# EAGLE design rx5808 vTup 1.1 (restored) (EAGLE 7.4.0)
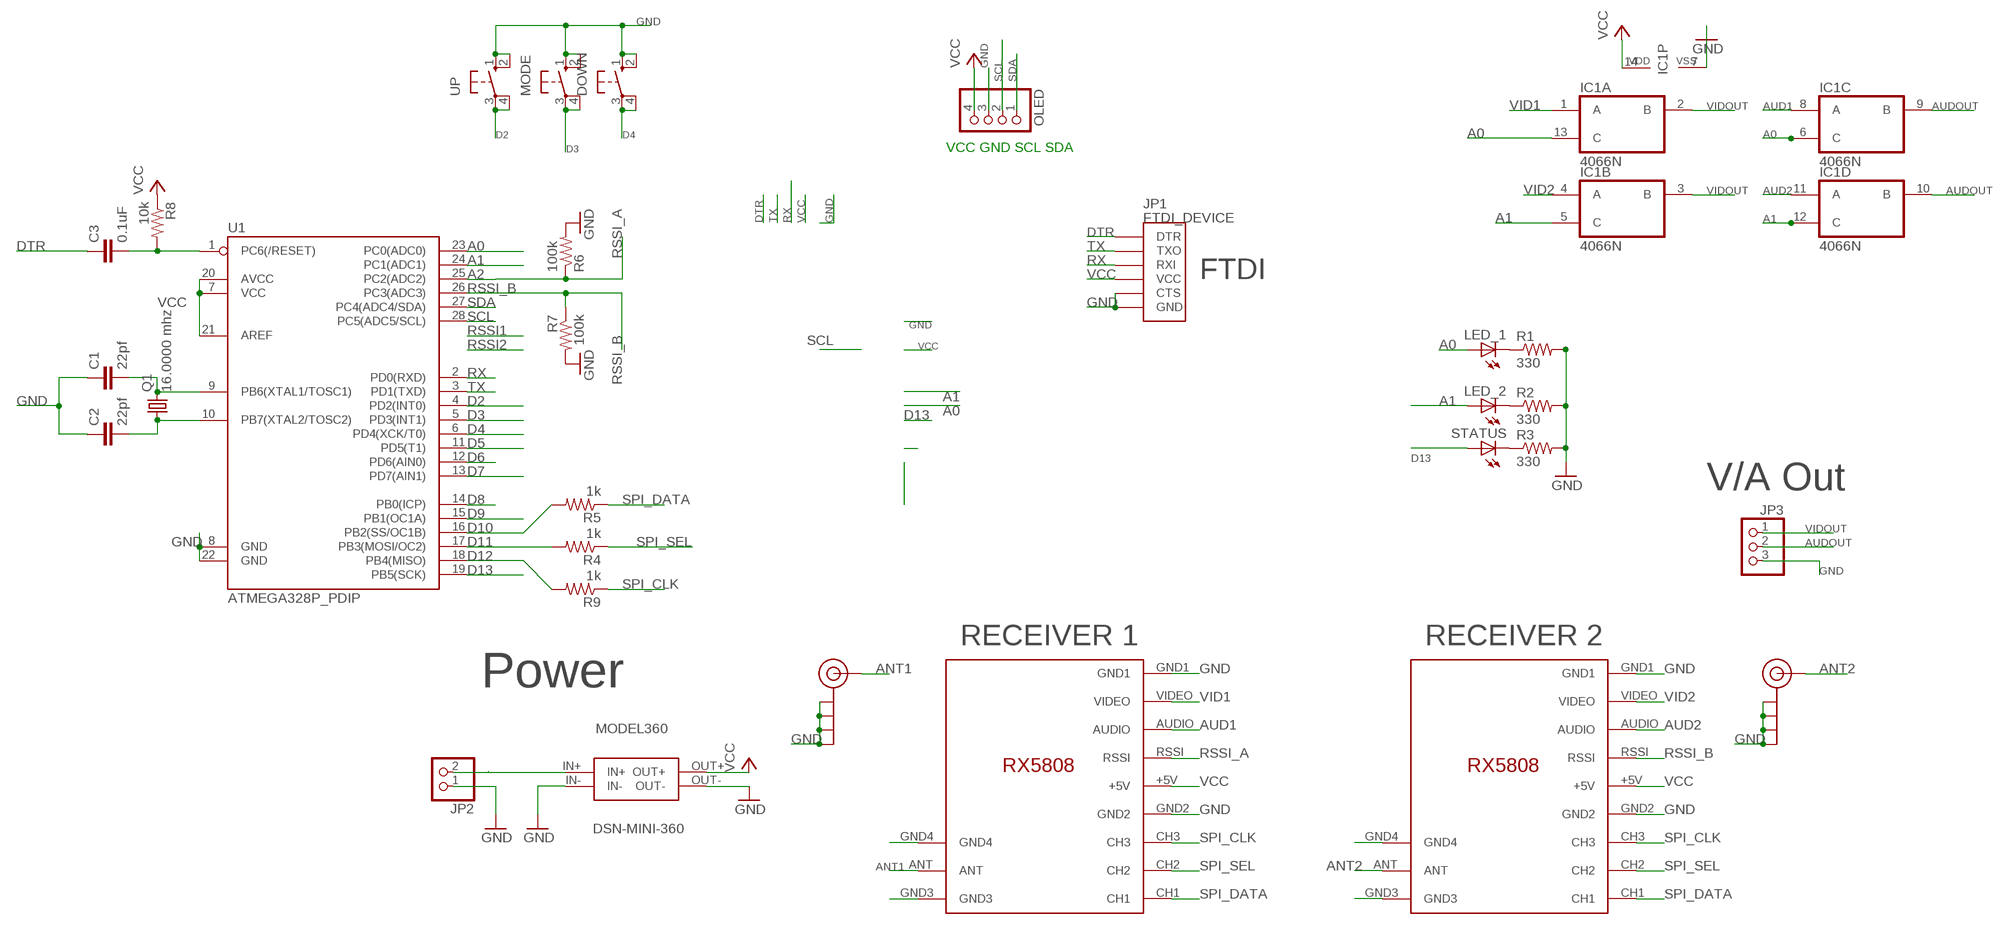
[diagram p0: schematic, sheet 1]

## Parts
ANT1  SMA_EDGE  [SMA-EDGE]
ANT2  SMA_EDGE  [SMA-EDGE]
C1  22pf  C-EU025-025X050  [C025-025X050]
C2  22pf  C-EU025-025X050  [C025-025X050]
C3  0.1uF  C-EU025-025X050  [C025-025X050]
DOWN  10-XX  [B3F-10XX]
DSN-MINI-360  MODEL360  [MODEL360]
IC1  4066N  [DIL14]
JP1  FTDI_DEVICE  [FTDI_DEVICE_SIDE]
JP2  PINHD-1X2  [1X02]
JP3  PINHD-1X3  [1X03]
LED_1  LED5MM  [LED5MM]
LED_2  LED5MM  [LED5MM]
MODE  10-XX  [B3F-10XX]
OLED  PINHD-1X4  [1X04]
Q1  16.0000 mhz  CRYSTALHC49U-V  [HC49U-V]
R1  330  R-US_0207/7  [0207/7]
R2  330  R-US_0207/7  [0207/7]
R3  330  R-US_0207/7  [0207/7]
R4  1k  R-US_0207/7  [0207/7]
R5  1k  R-US_0207/7  [0207/7]
R6  100k  R-US_0207/7  [0207/7]
R7  100k  R-US_0207/7  [0207/7]
R8  10k  R-US_0207/7  [0207/7]
R9  1k  R-US_0207/7  [0207/7]
RECEIVER_A  RX5808_A  RX5808  [RX5808]
RECEIVER_B  RX5808_B  RX5808  [RX5808]
STATUS  LED5MM  [LED5MM]
U1  ATMEGA328P_PDIP  [DIL28-3]
UP  10-XX  [B3F-10XX]

## Nets
A0: IC1.6(C:C) IC1.13(A:C) LED_1.A U1.23(PC0(ADC0))
A1: IC1.5(B:C) IC1.12(D:C) LED_2.A U1.24(PC1(ADC1))
A2: U1.25(PC2(ADC2))
ANT1: ANT1.SIG(SIGNAL) RECEIVER_A.ANT
ANT2: ANT2.SIG(SIGNAL) RECEIVER_B.ANT
AUD1: IC1.8(C:A) RECEIVER_A.AUDIO
AUD2: IC1.11(D:A) RECEIVER_B.AUDIO
AUDOUT: IC1.9(C:B) IC1.10(D:B) JP3.2
D2: U1.4(PD2(INT0)) UP.3(P) UP.4(P1)
D3: MODE.3(P) MODE.4(P1) U1.5(PD3(INT1))
D4: DOWN.3(P) DOWN.4(P1) U1.6(PD4(XCK/T0))
D5: U1.11(PD5(T1))
D6: U1.12(PD6(AIN0))
D7: U1.13(PD7(AIN1))
D8: U1.14(PB0(ICP))
D9: U1.15(PB1(OC1A))
D10: R5.2 U1.16(PB2(SS/OC1B))
D11: R4.2 U1.17(PB3(MOSI/OC2))
D12: R9.2 U1.18(PB4(MISO))
D13: STATUS.A U1.19(PB5(SCK))
DTR: C3.1 JP1.P$1(DTR)
GND: ANT1.GND@0(GND) ANT1.GND@1(GND) ANT1.GND@2(GND) ANT1.GND@3(GND) ANT2.GND@0(GND) ANT2.GND@1(GND) ANT2.GND@2(GND) ANT2.GND@3(GND) C1.1 C2.1 DOWN.1(S) DOWN.2(S1) DSN-MINI-360.IN- DSN-MINI-360.OUT- IC1.7(P:VSS) JP1.P$5(CTS) JP1.P$6(GND) JP2.1 JP3.3 MODE.1(S) MODE.2(S1) OLED.3 R1.2 R2.2 R3.2 R6.2 R7.2 RECEIVER_A.GND1 RECEIVER_A.GND2 RECEIVER_A.GND3 RECEIVER_A.GND4 RECEIVER_B.GND1 RECEIVER_B.GND2 RECEIVER_B.GND3 RECEIVER_B.GND4 U1.8(GND) U1.22(GND) UP.1(S) UP.2(S1)
N$1: LED_1.K(C) R1.1
N$2: LED_2.K(C) R2.1
N$3: R3.1 STATUS.K(C)
N$5: DSN-MINI-360.IN+ JP2.2
N$6: C1.2 Q1.2 U1.9(PB6(XTAL1/TOSC1))
N$7: C2.2 Q1.1 U1.10(PB7(XTAL2/TOSC2))
RESET: C3.2 R8.2 U1.1(PC6(/RESET))
RSSI_A: R6.1 RECEIVER_A.RSSI
RSSI_B: R7.1 RECEIVER_B.RSSI U1.26(PC3(ADC3))
RX: JP1.P$3(RXI) U1.2(PD0(RXD))
SCL: OLED.2 U1.28(PC5(ADC5/SCL))
SDA: OLED.1 U1.27(PC4(ADC4/SDA))
SPI_CLK: R9.1 RECEIVER_A.CH3 RECEIVER_B.CH3
SPI_DATA: R5.1 RECEIVER_A.CH1 RECEIVER_B.CH1
SPI_SEL: R4.1 RECEIVER_A.CH2 RECEIVER_B.CH2
TX: JP1.P$2(TXO) U1.3(PD1(TXD))
VCC: DSN-MINI-360.OUT+ IC1.14(P:VDD) JP1.P$4(VCC) OLED.4 R8.1 RECEIVER_A.+5V RECEIVER_B.+5V U1.7(VCC) U1.20(AVCC) U1.21(AREF)
VID1: IC1.1(A:A) RECEIVER_A.VIDEO
VID2: IC1.4(B:A) RECEIVER_B.VIDEO
VIDOUT: IC1.2(A:B) IC1.3(B:B) JP3.1

## Notes on the sheet
- VCC GND SCL SDA
- FTDI
- V/A Out
- RECEIVER 1 | RECEIVER 2
- Power

## Library data of the parts
ANT1 ANT2 = SparkFun-Connectors:SMA_EDGE: SMA Antenna Connector End launch SMA connector. The paste layer has been removed so that the connector can be hand soldered onto the board after reflow.
C1-C3 = resistor:C-EU: CAPACITOR, European symbol
DOWN MODE UP = switch-omron:10-XX: OMRON SWITCH; MPN: B3F-1000; OC_FARNELL: 176432; OC_NEWARK: 36M3542
DSN-MINI-360 = Model-360-Step-Down:MODEL360
IC1 = 40xx:4066: Quad bilateral ANALOG SWITCH
JP1 = SparkFun-Connectors:FTDI_DEVICE: Connector which mates to FTDI basic or FTDI cable.
JP2 = pinhead:PINHD-1X2: PIN HEADER
JP3 = pinhead:PINHD-1X3: PIN HEADER
LED_1 LED_2 STATUS = led:LED: LED OSRAM: - CHIPLED LG R971, LG N971, LY N971, LG Q971, LY Q971, LO R971, LY R971 LH N974, LH R974 LS Q976, LO Q976, LY Q976 LO Q996 - Hyper CHIPLED LW Q18S LB Q993, LB Q99A, LB R99A - SideLED LS A670, LO A670, LY A670, LG A670, LP A670 LB A673, LV A673, LT A673, LW A673 LH A674 LY A675 LS A676, LA A676, LO A676, LY A676, LW A676 LS A679, LY A679, LG A679 - Hyper Micro SIDELED® LS Y876, LA Y876, LO Y876, LY Y876 LT Y87S - SmartLED LW L88C, LW L88S LB L89C, LB L89S, LG L890 LS L89K, LO L89K, LY L89K LS L896, LA L896, LO L896, LY L896 - TOPLED LS T670, LO T670, LY T670, LG T670, LP T670 LSG T670, LSP T670, LSY T670, LOP T670, LYG T670 LG T671, LOG T671, LSG T671 LB T673, LV T673, LT T673, LW T673 LH T674 LS T676, LA T676, LO T676, LY T676, LB T676, LH T676, LSB T676, LW T676 LB T67C, LV T67C, LT T67C, LS T67K, LO T67K, LY T67K, LW E67C LS E67B, LA E67B, LO E67B, LY E67B, LB E67C, LV E67C, LT E67C LW T67C LS T679, LY T679, LG T679 LS T770, LO T770, LY T770, LG T770, LP T770 LB T773, LV T773, LT T773, LW T773 LH T774 LS E675, LA E675, LY E675, LS T675 LS T776, LA T776, LO T776, LY T776, LB T776 LHGB T686 LT T68C, LB T68C - Hyper Mini TOPLED® LB M676 - Mini TOPLED Santana® LG M470 LS M47K, LO M47K, LY M47K Source: http://www.osram.convergy.de LUXEON: - LUMILED® LXK2-PW12-R00, LXK2-PW12-S00, LXK2-PW14-U00, LXK2-PW14-V00 LXK2-PM12-R00, LXK2-PM12-S00, LXK2-PM14-U00 LXK2-PE12-Q00, LXK2-PE12-R00, LXK2-PE12-S00, LXK2-PE14-T00, LXK2-PE14-U00 LXK2-PB12-K00, LXK2-PB12-L00, LXK2-PB12-M00, LXK2-PB14-N00, LXK2-PB14-P00, LXK2-PB14-Q00 LXK2-PR12-L00, LXK2-PR12-M00, LXK2-PR14-Q00, LXK2-PR14-R00 LXK2-PD12-Q00, LXK2-PD12-R00, LXK2-PD12-S00 LXK2-PH12-R00, LXK2-PH12-S00 LXK2-PL12-P00, LXK2-PL12-Q00, LXK2-PL12-R00 Source: www.luxeon.com KINGBRIGHT: KA-3528ASYC Source: www.kingbright.com
OLED = pinhead:PINHD-1X4: PIN HEADER
Q1 = crystal:CRYSTAL: CRYSTAL; OC_FARNELL: 1666969; OC_NEWARK: unknown
R1-R9 = rcl:R-US_: RESISTOR, American symbol
RECEIVER_A RECEIVER_B = 1customstuff:RX5808
U1 = SparkFun-DigitalIC:ATMEGA328P_PDIP: uC used in the Arduino 32kb flash, 1k EEPROM, 2k SRAM This is the through-hole version of this chip.

## Board
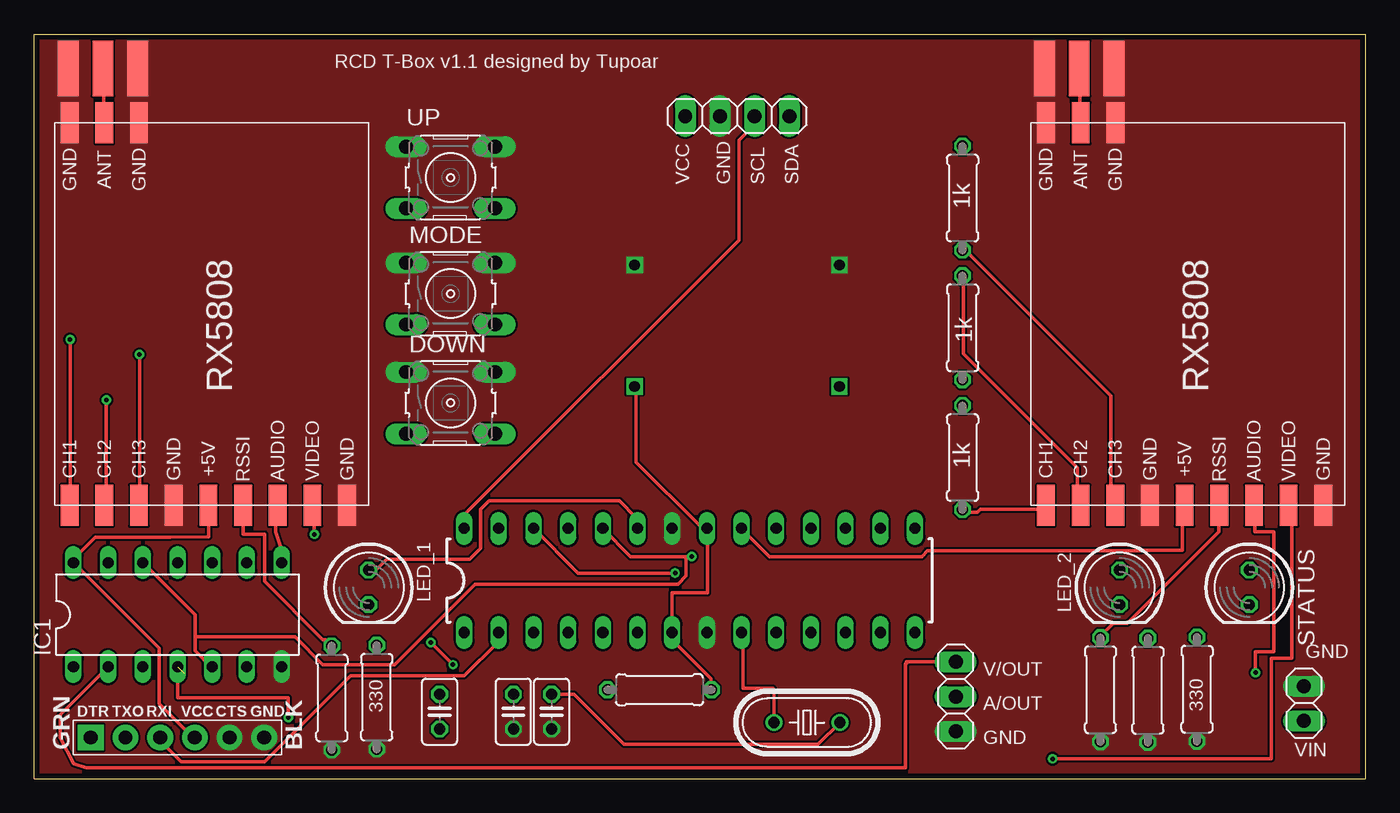
[diagram p1: board, top side]
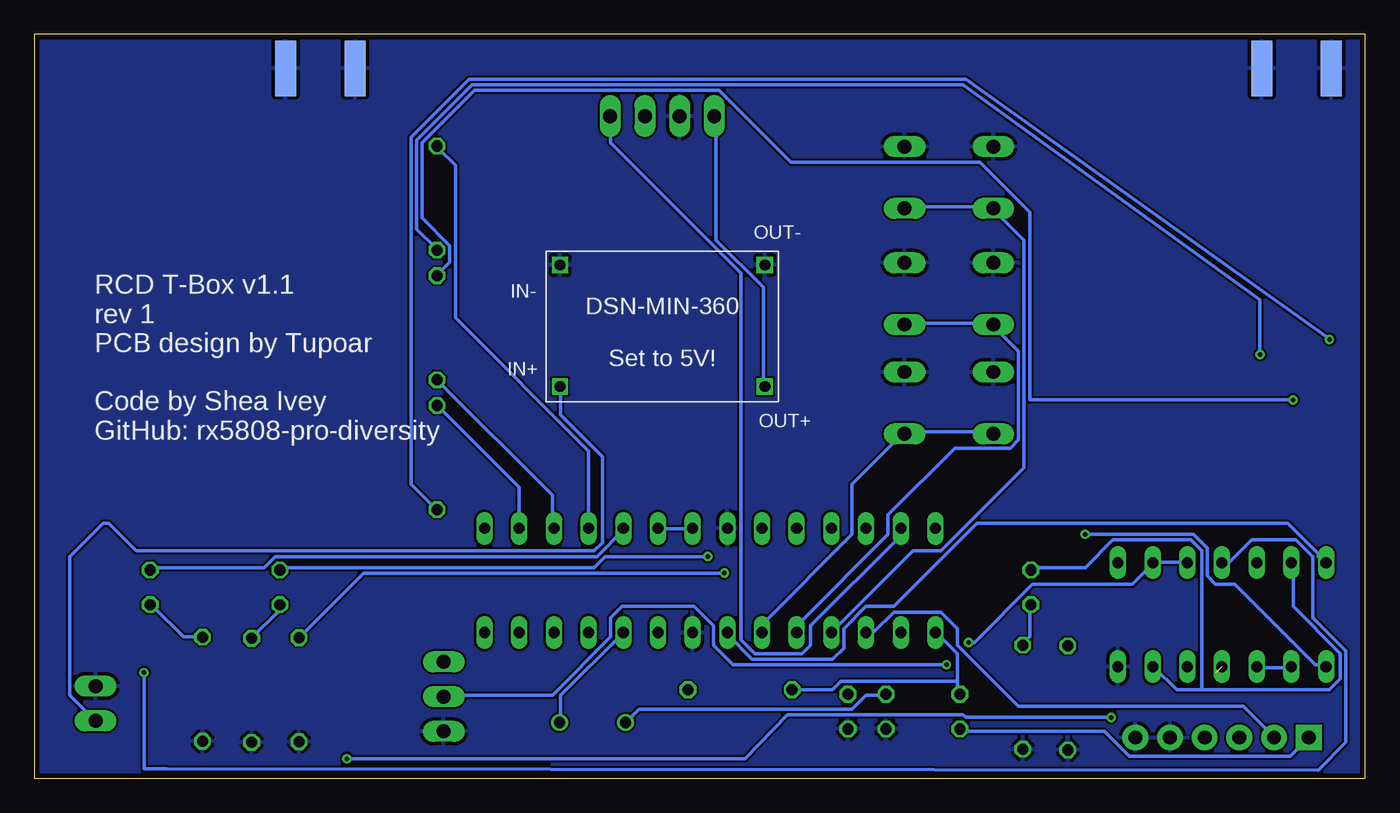
[diagram p2: board, bottom side, seen from below]

Size 97.5 x 54.5 mm. Coordinates in mm from the lower left corner, seen from the top.
Outline: 0,0 97.5,0 97.5,54.5 0,54.5 0,0
Copper layers (1*16): Top 0.0356mm / dielectric 1.5011mm / Bottom 0.0356mm
Design rules "LaenPCBOrder *": minimum track width 10mil, minimum drill 13mil, track to track 6mil, track to pad 6mil, pad to pad 6mil, via to via 30mil, smd to smd 6mil, copper to edge 15mil, drill to drill 6mil, minimum pad ring 7mil, minimum via ring 7mil, stop-mask expansion 3mil, vias tented up to drill 0mil, thermal gap 10mil

### Footprints (pad centres in the part's own frame; a part is rotated, then mirrored left to right if it is on the bottom)
SMA-EDGE = smd 1.524 x 4.064: GND@0 0,0; GND@1 5.08,0; SIG 2.54,0 | smd 1.524 x 4.064 bottom: GND@2 0,0; GND@3 5.08,0
C025-025X050 = drill 0.813 octagon: 1 -1.27,0; 2 1.27,0
B3F-10XX = drill 1.016 long: 1 -3.251,2.261; 2 3.251,2.261; 3 -3.251,-2.261; 4 3.251,-2.261
MODEL360 = drill 0.8 square: IN+ 1.02,-7.4; IN- 1.02,1.5; OUT+ 16.02,-7.4; OUT- 16.02,1.5
DIL14 = drill 0.813 long: 1 -7.62,-3.81; 2 -5.08,-3.81; 3 -2.54,-3.81; 4 0,-3.81; 5 2.54,-3.81; 6 5.08,-3.81; 7 7.62,-3.81; 8 7.62,3.81; 9 5.08,3.81; 10 2.54,3.81; 11 0,3.81; 12 -2.54,3.81; 13 -5.08,3.81; 14 -7.62,3.81
FTDI_DEVICE_SIDE = drill 1.016 pad 1.88 square: P$1 -6.35,0 | drill 1.016 pad 1.88: P$2 -3.81,0; P$3 -1.27,0; P$4 1.27,0; P$5 3.81,0; P$6 6.35,0
1X02 = drill 1.016 long: 1 -1.27,0; 2 1.27,0
1X03 = drill 1.016 long: 1 -2.54,0; 2 0,0; 3 2.54,0
LED5MM = drill 0.813 octagon: A -1.27,0; K 1.27,0
1X04 = drill 1.016 long: 1 -3.81,0; 2 -1.27,0; 3 1.27,0; 4 3.81,0
HC49U-V = drill 0.813: 1 -2.413,0; 2 2.413,0
0207/7 = drill 0.813 octagon: 1 -3.81,0; 2 3.81,0
RX5808 = smd 3 x 1.3: +5V 28,11.26; ANT 0,3.64; AUDIO 28,16.34; CH1 28,1.1; CH2 28,3.64; CH3 28,6.18; GND1 28,21.42; GND2 28,8.72; GND3 0,1.1; GND4 0,6.18; RSSI 28,13.8; VIDEO 28,18.88
DIL28-3 = drill 0.813 long: 1 -16.51,-3.81; 2 -13.97,-3.81; 3 -11.43,-3.81; 4 -8.89,-3.81; 5 -6.35,-3.81; 6 -3.81,-3.81; 7 -1.27,-3.81; 8 1.27,-3.81; 9 3.81,-3.81; 10 6.35,-3.81; 11 8.89,-3.81; 12 11.43,-3.81; 13 13.97,-3.81; 14 16.51,-3.81; 15 16.51,3.81; 16 13.97,3.81; 17 11.43,3.81; 18 8.89,3.81; 19 6.35,3.81; 20 3.81,3.81; 21 1.27,3.81; 22 -1.27,3.81; 23 -3.81,3.81; 24 -6.35,3.81; 25 -8.89,3.81; 26 -11.43,3.81; 27 -13.97,3.81; 28 -16.51,3.81

### Placement (x,y rotation side)
ANT1  2.5,52 0 top
ANT2  74,52 0 top
C1  35.1,4.9 90 top
C2  37.9,4.9 90 top
C3  29.7,4.9 90 top
DOWN  30.5,27.5 0 top
DSN-MINI-360  60,36.1 0 bottom
IC1  10.5,12 0 top
JP1  10.5,3 0 top
JP2  93,5.5 270 top
JP3  67.5,6 270 top
LED_1  24.5,14 270 top
LED_2  79.5,14 270 top
MODE  30.5,35.5 0 top
OLED  51.5,48.5 180 top
Q1  56.6,4.1 180 top
R1  25.09,5.96 270 top
R2  81.57,6.46 270 top
R3  85.17,6.54 270 top
R4  68,33 270 top
R5  68,23.5 90 top
R6  21.8,5.9 270 top
R7  78.1,6.5 270 top
R8  45.8,6.5 180 top
R9  68,42.5 90 top
RECEIVER_A  1.5,48 270 top
RECEIVER_B  73,48 270 top
STATUS  89,14 270 top
U1  48,14.5 0 top
UP  30.5,44 0 top

### Tracks (layer width: path | path; a pad name or v marks a point on that pad's centre or on a via)
A0
  Top 0.254: U1.23 44.09,18.49 44.09,19.1 42.88,20.32 33.33,20.32 32.72,19.71 32.72,16.87 31.9,16.05 25.81,16.05 24.99,15.24 24.59,15.24 LED_1.A
  Bottom 0.254: 11.99,6.5 13.82,6.5 15.44,8.13 IC1.6 | 11.99,6.5 2.64,6.5 1.83,7.32 1.83,9.14 5.28,12.6 5.28,15.65 IC1.13 | 11.99,6.5 11.99,16.66 12.8,17.48 18.49,17.48 20.52,15.44 24.38,15.44 LED_1.A
A1  (via drill 0.33)
  Top 0.254: 11.79,10.36 11.79,9.35 13.01,8.13 IC1.5 | 11.79,10.36 11.79,11.99 8.13,15.65 IC1.12 | v48.16,16.26 47.75,16.26 | 47.75,16.26 43.69,16.26 41.66,18.29 U1.24 | 11.79,10.36 19.1,10.36 21.13,8.33 26.42,8.33 32.31,14.22 47.14,14.22 47.75,14.83 47.75,16.26
  Bottom 0.254: v48.16,16.26 55.68,16.26 56.49,15.44 79.45,15.44 LED_2.A
ANT1
  Top 0.254: RECEIVER_A.ANT 5.08,48.16 5.08,51.82 ANT1.SIG
ANT2
  Top 0.254: RECEIVER_B.ANT 76.61,48.16 76.61,51.82 ANT2.SIG
AUD1
  Top 0.254: IC1.8 18.09,15.85 18.09,16.87 17.68,18.09 17.68,19.91 RECEIVER_A.AUDIO
AUD2  (via drill 0.33)
  Top 0.254: RECEIVER_B.AUDIO 89.41,19.91 89.41,18.09 90.8,18.09 90.8,9.3 89.45,9.3 v89.45,7.75
  Bottom 0.254: IC1.11 10.36,15.85 9.96,15.85 8.33,17.48 5.08,17.48 3.86,16.26 3.86,11.79 1.42,9.35 1.42,2.64 3.45,0.61 87.8,0.71 89.45,0.71 v89.45,7.75
AUDOUT  (via drill 0.33)
  Top 0.254: v29.06,9.96 v30.68,8.33
  Bottom 0.254: IC1.10 13.21,15.85 15.44,15.85 IC1.9 15.65,15.65 17.07,14.22 24.38,14.22 28.65,9.96 v29.06,9.96 | v30.68,8.33 46.33,8.33 47.75,9.75 47.75,11.18 49.17,12.6 54.46,12.6 55.27,11.79 55.27,10.36 59.54,6.1 67.46,6.1 JP3.2
D2
  Bottom 0.254: U1.4 39.01,10.77 33.12,16.66 31.09,16.66 24.99,22.76 24.99,39.42 27.23,41.66 UP.3 27.43,41.86 33.73,41.86 UP.4
D3
  Bottom 0.254: U1.5 41.45,10.77 41.45,11.38 34.95,17.88 34.95,19.3 30.07,24.18 26.01,24.18 25.4,24.79 25.4,31.29 27.23,33.12 MODE.3 27.43,33.33 33.73,33.33 MODE.4
D4
  Bottom 0.254: U1.6 44.09,10.77 44.09,11.38 37.59,17.88 37.59,21.54 33.93,25.2 DOWN.4 33.73,25.4 27.43,25.4 DOWN.3
D10
  Bottom 0.254: U1.16 61.98,18.49 61.98,21.34 67.87,27.23 R5.2
D11
  Bottom 0.254: U1.17 59.54,18.49 59.54,20.73 67.87,29.06 R4.2
D12
  Bottom 0.254: U1.18 56.9,18.49 56.9,23.98 66.65,33.73 66.65,44.91 67.87,46.13 R9.2
D13
  Bottom 0.254: STATUS.A 88.8,15.44 80.67,15.44 79.86,16.26 56.29,16.26 54.25,18.29 U1.19
DTR
  Bottom 0.254: C3.1 29.67,3.45 19.1,3.45 17.27,1.63 5.49,1.63 4.27,2.85 JP1.P$1
GND
  pour Bottom: 0,54.5 97.5,54.5 97.5,0 0,0
  pour Top (no thermals): 0,54.5 97.5,54.5 97.5,0 0,0
N$1
  Bottom 0.254: LED_1.K 24.59,12.6 24.59,10.36 24.99,9.96 R1.1
N$2
  Bottom 0.254: LED_2.K 79.65,12.6 79.65,12.19 81.48,10.36 R2.1
N$3
  Bottom 0.254: R3.1 85.34,10.36 86.56,10.36 88.8,12.6 STATUS.K
N$5
  Bottom 0.254: DSN-MINI-360.IN+ 58.93,28.65 58.93,26.62 55.88,23.57 55.88,17.27 56.49,16.66 90.02,16.66 92.05,18.69 92.46,18.69 94.89,16.26 94.89,6.1 93.07,4.27 JP2.2
N$6
  Top 0.254: Q1.2 54.19,6.5 54.1,6.5 54.1,6.6 51.9,6.6 51.9,10.57 51.82,10.57 U1.9
  Bottom 0.254: C1.2 35.15,6.1 36.58,6.1 37.59,5.08 53.21,5.08 Q1.2
N$7
  Top 0.254: C2.2 39.53,6.17 43.2,2.5 57.41,2.5 Q1.1
  Bottom 0.254: Q1.1 58.93,4.27 58.93,6.1 54.46,10.57 U1.10
RESET
  Bottom 0.254: 29.87,7.11 29.87,9.14 31.29,10.57 U1.1 | 29.87,7.11 29.87,6.3 C3.2 | 29.87,7.11 38.41,7.11 39.01,6.5 41.86,6.5 R8.2
RSSI_A
  Top 0.254: R6.1 21.74,9.75 21.34,10.16 21.13,10.16 16.87,14.43 16.87,17.9 15.3,17.9 RECEIVER_A.RSSI 15.44,19.91
RSSI_B  (via drill 0.33)
  Top 0.254: v46.94,15.04 39.83,15.04 U1.26 36.58,18.29 | RECEIVER_B.RSSI 86.77,19.91 86.77,18.09 80.06,11.38 79.05,11.38 78.03,10.36 R7.1
  Bottom 0.254: v46.94,15.04 73.36,15.04 78.03,10.36 R7.1
RX
  Top 0.254: U1.2 33.93,10.57 33.93,9.96 31.5,7.52 23.16,7.52 16.87,1.22 10.77,1.22 9.14,2.85 JP1.P$3
SCL
  Top 0.254: U1.28 31.5,18.49 31.5,19.3 51.61,39.42 51.61,46.74 52.63,47.75 52.63,48.36 OLED.2
SDA
  Bottom 0.254: U1.27 34.14,18.29 34.14,17.68 40.64,11.18 40.64,9.75 41.25,9.14 44.7,9.14 45.72,10.16 45.72,36.98 55.27,46.53 55.27,48.36 OLED.1
SPI_CLK  (via drill 0.33)
  Top 0.254: R9.1 68.07,38.61 68.28,38.61 78.84,28.04 78.84,20.32 79.05,20.12 RECEIVER_B.CH3 | v7.72,31.05 7.72,20.12 RECEIVER_A.CH3
  Bottom 0.254: v7.72,31.05 7.72,35.06 29.46,50.8 65.43,50.8 69.49,46.74 69.49,40.23 68.07,38.81 R9.1
SPI_DATA  (via drill 0.33)
  Top 0.254: R5.1 68.07,19.51 69.09,19.51 69.29,19.71 73.76,19.71 73.97,19.91 RECEIVER_B.CH1 | v2.64,32.15 2.64,20.12 RECEIVER_A.CH1
  Bottom 0.254: v2.64,32.15 2.64,32.19 29.26,51.21 65.63,51.21 69.9,46.94 69.9,21.54 68.07,19.71 R5.1
SPI_SEL  (via drill 0.33)
  Top 0.254: R4.1 68.07,36.78 68.07,31.09 76.4,22.76 76.4,20.32 76.61,20.12 RECEIVER_B.CH2 | RECEIVER_A.CH2 5.28,20.12 5.28,27.72 v5.3,27.72
  Bottom 0.254: R4.1 67.87,36.98 67.06,37.8 67.06,39.01 69.09,41.05 69.09,46.53 65.23,50.39 47.35,50.39 42.06,45.11 28.25,45.11 24.59,41.45 24.59,27.72 v5.3,27.72
TX
  Bottom 0.254: U1.3 36.37,10.77 35.97,10.77 34.54,12.19 31.09,12.19 29.87,10.97 29.87,9.75 25.4,5.28 8.94,5.28 6.71,3.05 JP1.P$2
VCC
  Top 0.254: 12.8,19.91 RECEIVER_A.+5V 12.8,17.7 9.96,17.68 4.47,17.68 3.05,16.26 3.05,15.85 IC1.14 3.05,15.65 9.14,9.55 9.14,5.49 11.58,3.05 JP1.P$4 | R8.1 49.58,6.5 49.58,7.32 46.74,10.16 46.74,10.57 U1.7 46.73,13.6 49.3,13.6 49.3,18.31 U1.21 49.17,18.49 48.77,18.49 44.09,23.16 44.09,28.65 DSN-MINI-360.OUT+ | RECEIVER_B.+5V 84.12,19.91 84.1,19.91 84.1,16.7 81.08,16.7 81.08,16.66 65.43,16.66 65.02,16.26 53.85,16.26 51.82,18.29 U1.20
  Bottom 0.254: DSN-MINI-360.OUT+ 44.09,28.85 44.09,35.97 47.55,39.42 47.55,48.36 OLED.4 | U1.20 51.61,18.29 49.38,18.29 U1.21 | IC1.14 3.05,15.85 3.45,16.26 3.45,16.46 5.69,18.69 28.45,18.69 34.54,12.6 36.58,12.6 38.2,10.97 38.2,9.55 39.01,8.74 44.91,8.74 46.74,10.57 U1.7
VID1  (via drill 0.33)
  Top 0.254: v20.51,17.88 20.52,18.49 20.52,19.91 RECEIVER_A.VIDEO
  Bottom 0.254: IC1.1 3.05,8.33 3.66,8.33 9.55,14.22 10.97,14.22 11.58,14.83 11.58,16.87 12.6,17.88 v20.51,17.88
VID2  (via drill 0.33)  (1 unrouted)
  Top 0.254: 10.97,7.52 10.97,7.72 | RECEIVER_B.VIDEO 92.05,19.91 92.1,19.91 92.1,8.8 90.6,8.8 90.6,1.45 v74.6,1.45 | IC1.4 10.5,5.9 18.6,5.9 18.6,4.47 v18.62,4.47
  Bottom 0.254: v18.62,4.47 29.26,4.47 29.46,4.67 42.32,4.67 45.45,1.45 v74.6,1.45
VIDOUT
  Top 0.254: JP3.1 63.9,8.54 63.9,8.4 63.8,8.4 63.8,0.8 3.8,0.8 2.9,1.1 1.9,3 1.9,4.67 IC1.2
  Bottom 0.254: IC1.2 5.49,8.13 7.92,8.13 IC1.3

### Text on the board
tPlace: RCD T-Box v1.1 designed by Tupoar | VCC | GND | SCL | SDA | GND | V/OUT | A/OUT | GND | VIN
bPlace: OUT- | IN- | DSN-MIN-360 / / Set to 5V! | IN+ | OUT+
bNames: RCD T-Box v1.1 / rev 1 / PCB design by Tupoar / / Code by Shea Ivey / GitHub: rx5808-pro-diversity